# EAGLE design pc_to_pc_communication (EAGLE 7.1.0)
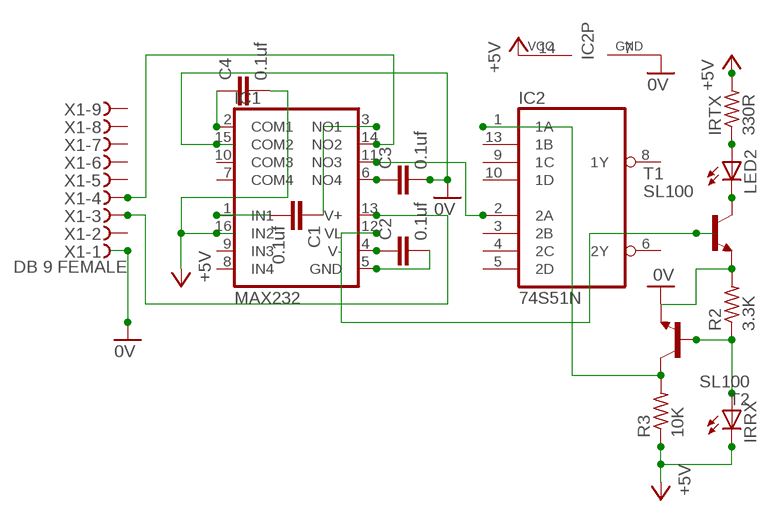
[diagram p0: schematic, sheet 1]

## Parts
C1  0.1uf  C2,5-3  [C2.5-3]
C2  0.1uf  C2,5-3  [C2.5-3]
C3  0.1uf  C2,5-3  [C2.5-3]
C4  0.1uf  C2,5-3  [C2.5-3]
IC1  MAX232  MAX313EPE  [DIL16]
IC2  74S51N  [DIL14]
IRRX  LED3MM  [LED3MM]
IRTX  330R  R-US_0204/7  [0204/7]
LED2  LED3MM  [LED3MM]
R2  3.3K  R-US_0204/7  [0204/7]
R3  10K  R-US_0204/7  [0204/7]
T1  SL100  2N2102  [TO5]
T2  SL100  2N2102  [TO5]
X1  DB 9 FEMALE  D-SUB9-H2M09ST  [H2M09ST]

## Nets
0V: C3.2 IC1.15(COM2) IC2.7(GND) R2.2 T1.1(E) T2.1(E) X1.1
+5V: C4.2 IC1.16(IN2) IC2.14(VCC) IRRX.K(C) IRTX.2 R3.1
N$1: C1.2 IC1.1(IN1)
N$2: C1.1 IC1.3(NO1)
N$3: C2.1 IC1.4(V-)
N$4: C2.2 IC1.5(GND)
N$5: C3.1 IC1.6(NO4)
N$6: LED2.K(C) T1.3(C)
N$7: C4.1 IC1.2(COM1)
N$8: IRTX.1 LED2.A
N$9: IC1.13(V+) X1.3
N$10: IC1.14(NO2) X1.4
N$11: IC1.11(NO3) IC2.2(2A)
N$12: IC1.12(VL) T1.2(B)
N$14: IRRX.A R2.1 T2.2(B)
N$15: IC2.1(1A) R3.2 T2.3(C)
Unconnected: IC1.7(COM4) IC1.8(IN4) IC1.9(IN3) IC1.10(COM3) IC2.3(2B) IC2.4(2C) IC2.5(2D) IC2.6(2Y) IC2.8(1Y) IC2.9(1C) IC2.10(1D) IC2.13(1B) X1.2 X1.5 X1.6 X1.7 X1.8 X1.9

## Library data of the parts
C1-C4 = capacitor-wima:C: CAPACITOR naming: grid - package width
IC1 = maxim:MAX313: 10?, Quad, SPST, CMOS Analog Switches Source: http://datasheets.maxim-ic.com/en/ds/MAX312-MAX314.pdf; MPN: MAX313EPE+; OC_FARNELL: unknown; OC_NEWARK: 99K3220
IC2 = 74xx-us:74S51: AND OR INVERTER gates/for LS-type see 74*51 <DEVICE:74*51>
IRRX LED2 = led:LED: LED OSRAM: - CHIPLED LG R971, LG N971, LY N971, LG Q971, LY Q971, LO R971, LY R971 LH N974, LH R974 LS Q976, LO Q976, LY Q976 LO Q996 - Hyper CHIPLED LW Q18S LB Q993, LB Q99A, LB R99A - SideLED LS A670, LO A670, LY A670, LG A670, LP A670 LB A673, LV A673, LT A673, LW A673 LH A674 LY A675 LS A676, LA A676, LO A676, LY A676, LW A676 LS A679, LY A679, LG A679 - Hyper Micro SIDELED® LS Y876, LA Y876, LO Y876, LY Y876 LT Y87S - SmartLED LW L88C, LW L88S LB L89C, LB L89S, LG L890 LS L89K, LO L89K, LY L89K LS L896, LA L896, LO L896, LY L896 - TOPLED LS T670, LO T670, LY T670, LG T670, LP T670 LSG T670, LSP T670, LSY T670, LOP T670, LYG T670 LG T671, LOG T671, LSG T671 LB T673, LV T673, LT T673, LW T673 LH T674 LS T676, LA T676, LO T676, LY T676, LB T676, LH T676, LSB T676, LW T676 LB T67C, LV T67C, LT T67C, LS T67K, LO T67K, LY T67K, LW E67C LS E67B, LA E67B, LO E67B, LY E67B, LB E67C, LV E67C, LT E67C LW T67C LS T679, LY T679, LG T679 LS T770, LO T770, LY T770, LG T770, LP T770 LB T773, LV T773, LT T773, LW T773 LH T774 LS E675, LA E675, LY E675, LS T675 LS T776, LA T776, LO T776, LY T776, LB T776 LHGB T686 LT T68C, LB T68C - Hyper Mini TOPLED® LB M676 - Mini TOPLED Santana® LG M470 LS M47K, LO M47K, LY M47K Source: http://www.osram.convergy.de LUXEON: - LUMILED® LXK2-PW12-R00, LXK2-PW12-S00, LXK2-PW14-U00, LXK2-PW14-V00 LXK2-PM12-R00, LXK2-PM12-S00, LXK2-PM14-U00 LXK2-PE12-Q00, LXK2-PE12-R00, LXK2-PE12-S00, LXK2-PE14-T00, LXK2-PE14-U00 LXK2-PB12-K00, LXK2-PB12-L00, LXK2-PB12-M00, LXK2-PB14-N00, LXK2-PB14-P00, LXK2-PB14-Q00 LXK2-PR12-L00, LXK2-PR12-M00, LXK2-PR14-Q00, LXK2-PR14-R00 LXK2-PD12-Q00, LXK2-PD12-R00, LXK2-PD12-S00 LXK2-PH12-R00, LXK2-PH12-S00 LXK2-PL12-P00, LXK2-PL12-Q00, LXK2-PL12-R00 Source: www.luxeon.com KINGBRIGHT: KA-3528ASYC Source: www.kingbright.com
IRTX R2 R3 = resistor:R-US_: RESISTOR, American symbol
T1 T2 = transistor-neu-to92:2N2102: NPN TRANSISTOR
X1 = con-thomas-betts:D-SUB9-: D-Subminiatur Connector Source: Electronioc Interconnects European Edition 1998; OC_FARNELL: unknown; OC_NEWARK: unknown

## Board
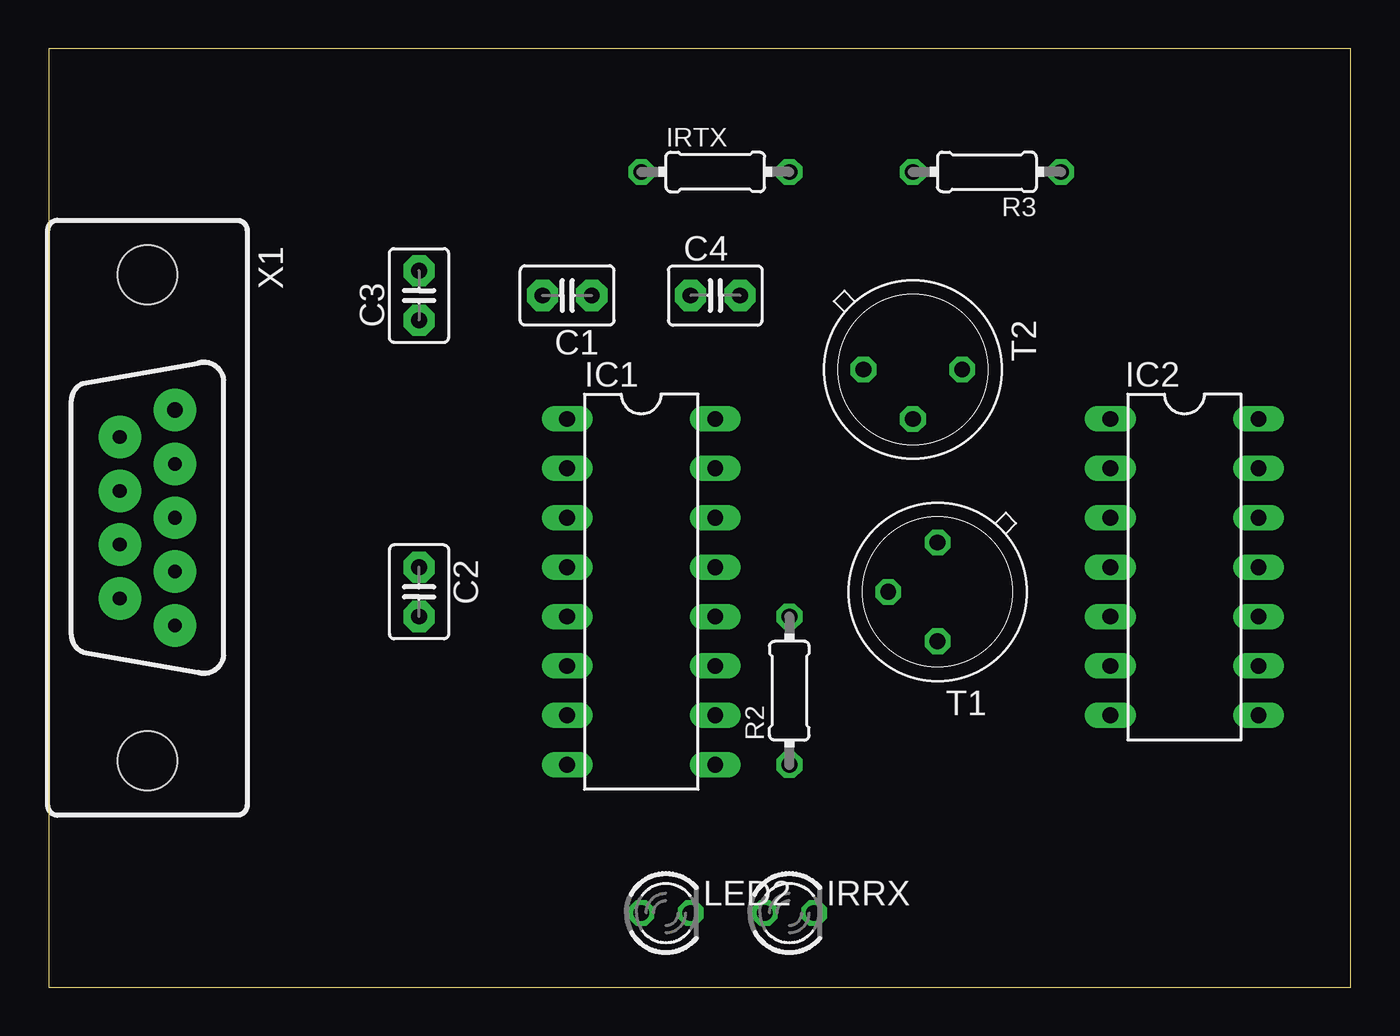
[diagram p1: board, top side]
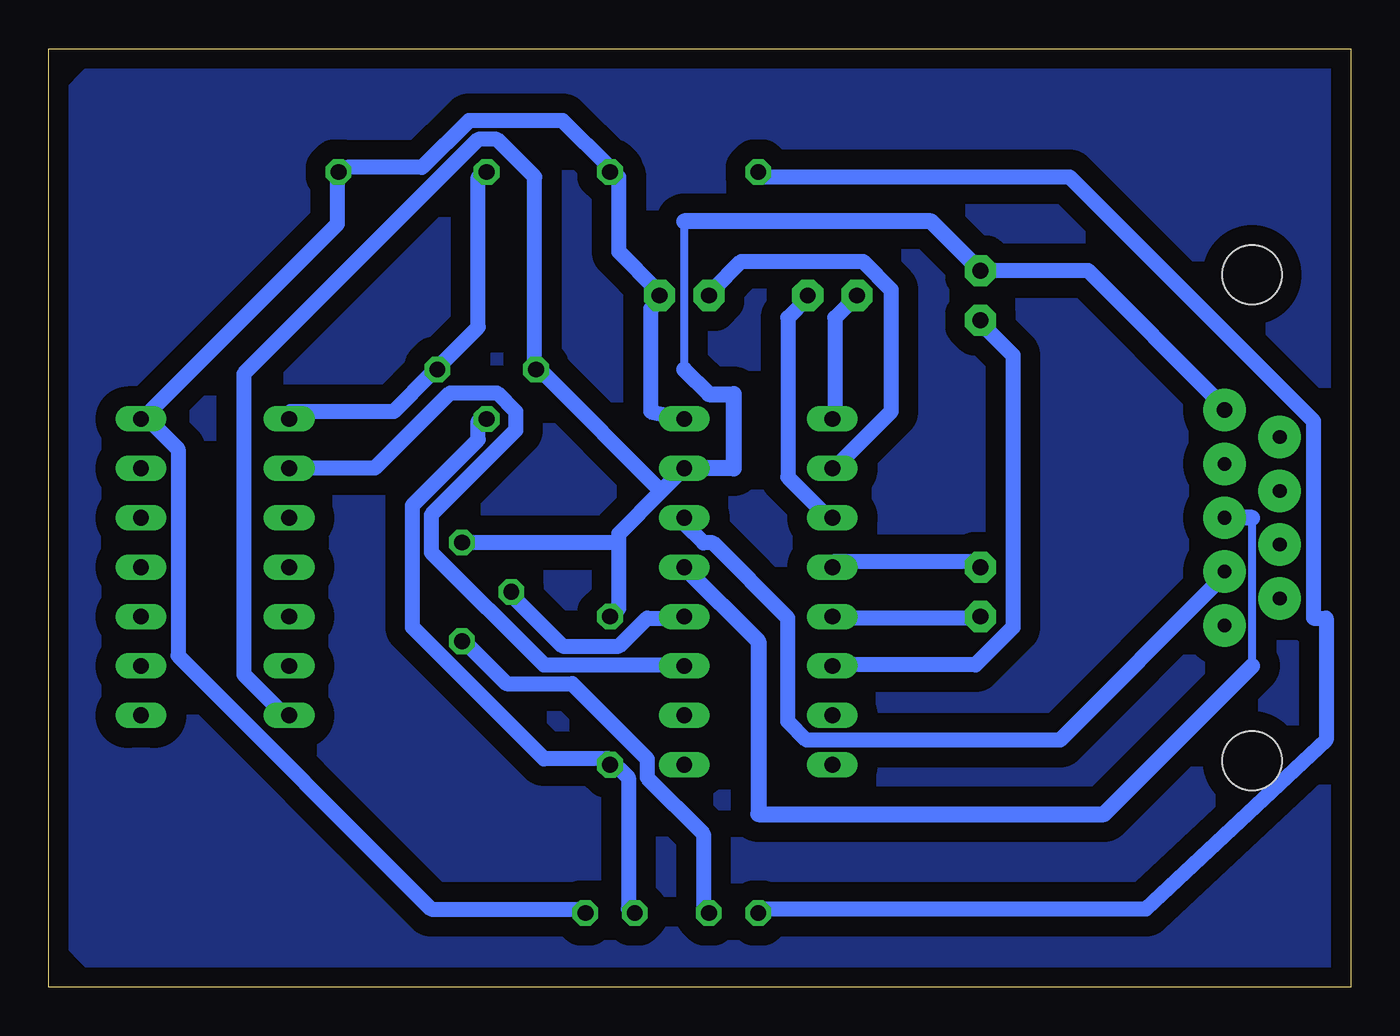
[diagram p2: board, bottom side, seen from below]

Size 66.98 x 48.25 mm. Coordinates in mm from the lower left corner, seen from the top.
Outline: 0,0 66.98,0 66.98,48.25 0,48.25 0,0
Copper layers (1*16): Top 0.035mm / dielectric 1.5mm / Bottom 0.035mm
Design rules "default *": minimum track width 30mil, minimum drill 24mil, track to track 8mil, track to pad 8mil, pad to pad 8mil, via to via 8mil, smd to smd 8mil, copper to edge 40mil, drill to drill 8mil, minimum pad ring 10mil, minimum via ring 8mil, stop-mask expansion 4mil, vias tented up to drill 0mil, thermal gap 10mil

### Footprints (pad centres in the part's own frame; a part is rotated, then mirrored left to right if it is on the bottom)
C2.5-3 = drill 0.813 pad 1.6 octagon: 1 -1.27,0; 2 1.27,0
DIL16 = drill 0.813 long: 1 -8.89,-3.81; 2 -6.35,-3.81; 3 -3.81,-3.81; 4 -1.27,-3.81; 5 1.27,-3.81; 6 3.81,-3.81; 7 6.35,-3.81; 8 8.89,-3.81; 9 8.89,3.81; 10 6.35,3.81; 11 3.81,3.81; 12 1.27,3.81; 13 -1.27,3.81; 14 -3.81,3.81; 15 -6.35,3.81; 16 -8.89,3.81
DIL14 = drill 0.813 long: 1 -7.62,-3.81; 2 -5.08,-3.81; 3 -2.54,-3.81; 4 0,-3.81; 5 2.54,-3.81; 6 5.08,-3.81; 7 7.62,-3.81; 8 7.62,3.81; 9 5.08,3.81; 10 2.54,3.81; 11 0,3.81; 12 -2.54,3.81; 13 -5.08,3.81; 14 -7.62,3.81
LED3MM = drill 0.813 octagon: A -1.27,0; K 1.27,0
0204/7 = drill 0.813 octagon: 1 -3.81,0; 2 3.81,0
TO5 = drill 0.813 octagon: 1 0,-2.54; 2 2.54,0; 3 0,2.54
H2M09ST = drill 0.8 pad 2.184: 1 -5.537,1.422 | drill 0.7 pad 2.184: 2 -2.769,1.422; 3 0,1.422; 4 2.769,1.422; 5 5.537,1.422; 6 -4.153,-1.422; 7 -1.384,-1.422; 8 1.384,-1.422; 9 4.153,-1.422 | hole 3.048: -12.497,0; 12.497,0

### Placement (x,y rotation side)
C1  26.67,35.56 180 top
C2  19.05,20.32 270 top
C3  19.05,35.56 90 top
C4  34.29,35.56 0 top
IC1  30.48,20.32 270 top
IC2  58.42,21.59 270 top
IRRX  38.1,3.81 0 top
IRTX  34.29,41.91 0 top
LED2  31.75,3.81 0 top
R2  38.1,15.24 90 top
R3  48.26,41.91 180 top
T1  45.72,20.32 180 top
T2  44.45,31.75 270 top
X1  5.08,24.13 270 top

### Tracks (layer width: path | path; a pad name or v marks a point on that pad's centre or on a via)
0V
  Bottom 0.406: 34.29,39.37 34.29,31.75
  Bottom 0.762: 35.47,25.49 37.64,23.32 37.64,22.84 | 35.47,25.49 IC1.15 | 37.64,22.84 37.64,19.46 R2.2 | 37.64,22.84 45.36,22.84 T1.1 | IC2.7 55.02,14.15 56.95,16.08 56.95,31.52 44.88,43.59 43.92,43.59 41.99,41.66 41.99,32 T2.1 41.5,31.52 35.47,25.49 | C3.2 13.51,36.83 6.76,30.07 X1.1
  Bottom 0.813: C3.2 21.59,39.37 34.29,39.37 | 34.29,31.75 33.02,30.48 31.75,30.48 31.75,26.67 IC1.15
+5V
  Bottom 0.762: IC1.16 36.02,29.59 36.02,34.9 35.23,35.38 C4.2 35.71,35.87 37.64,37.8 37.64,41.66 IRTX.2 38.12,42.14 40.54,44.55 45.36,44.55 47.78,42.14 51.64,42.14 R3.1 52.12,41.66 52.12,39.24 61.77,29.59 IC2.14 61.77,29.11 60.33,27.66 60.33,17.04 47.3,4.01 39.57,4.01 IRRX.K
N$1
  Bottom 0.762: C1.2 26.54,34.42 26.54,29.59 IC1.1
N$2
  Bottom 0.762: IC1.3 27.03,24.28 28.96,26.21 28.96,34.42 27.99,35.38 C1.1
N$3
  Bottom 0.762: IC1.4 26.54,21.87 19.3,21.87 C2.1
N$4
  Bottom 0.762: IC1.5 26.54,18.97 19.3,18.97 C2.2
N$5
  Bottom 0.762: IC1.6 26.54,16.56 19.3,16.56 17.37,18.49 17.37,32.49 18.82,33.93 C3.1
N$6
  Bottom 0.762: LED2.K 33.3,4.01 33.3,7.87 36.2,10.77 36.2,11.73 40.06,15.6 43.43,15.6 45.36,17.53 T1.3
N$7
  Bottom 0.762: IC1.2 26.54,26.7 23.65,29.59 23.65,35.87 25.09,37.31 31.37,37.31 32.82,35.87 C4.1
N$8
  Bottom 0.762: LED2.A 30.4,4.01 10.54,4.01 1.27,12.7 1.27,18.97 1.93,18.97 1.93,29.11 14.48,41.66 30.4,41.66 IRTX.1
N$9
  Bottom 0.406: 5.08,16.51 5.08,24.13
  Bottom 0.813: IC1.13 30.48,17.78 30.48,8.89 12.7,8.89 5.08,16.51 | 5.08,24.13 X1.3
N$10
  Bottom 0.762: IC1.14 34.27,23.8 33.3,22.84 32.82,22.84 28.96,18.97 28.96,13.66 27.99,12.7 14.96,12.7 6.76,20.9 X1.4
N$11
  Bottom 0.762: IC1.11 34.75,16.56 41.5,16.56 47.3,22.35 47.3,24.28 42.95,28.63 42.95,29.59 43.92,30.56 46.33,30.56 50.19,26.7 54.53,26.7 IC2.2
N$12
  Bottom 0.762: IC1.12 34.75,18.97 36.2,18.97 37.64,17.53 40.54,17.53 42.95,19.94 T1.2
N$13
  pour Bottom (isolate 1.016): 2.54,0 0,2.54 0,45.72 2.54,48.26 63.5,48.26 67.31,44.45 67.31,3.81 63.5,0
N$14
  Bottom 0.762: IRRX.A 37.16,4.01 37.16,10.77 37.64,11.25 R2.1 38.12,11.73 41.5,11.73 48.26,18.49 48.26,24.77 44.88,28.14 44.88,29.11 T2.2
N$15
  Bottom 0.762: IC2.1 54.53,29.59 49.23,29.59 47.3,31.52 T2.3 46.81,32 44.88,33.93 44.88,41.66 R3.2